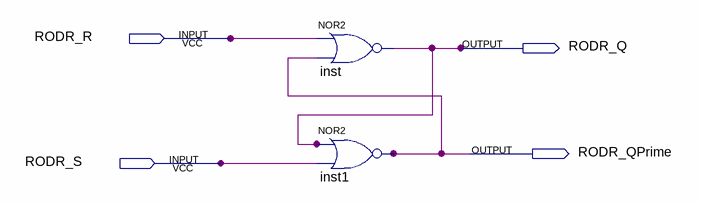
[diagram p0: schematic sheet]
// Quartus schematic RODR_SRLatch.bdf as structural Verilog: 2 symbols, 4 pins
module RODR_SRLatch (
  input  RODR_R,
  input  RODR_S,
  output RODR_Q,
  output RODR_QPrime
);

  nor inst (RODR_Q, RODR_R, RODR_QPrime);
  nor inst1 (RODR_QPrime, RODR_Q, RODR_S);
endmodule
